# Altium schematic sheet 19 RADIATOR.SchDoc
size 420 x 297 mm; Address1: Address1; Address2: Address2; Address3: Address3; Address4: Address4; DocumentNumber: АБВГ.123456.001 Э3; SheetNumber: 19; SheetTotal: 23; Scale: 1:1; DocumentType: Схема электрическая принципиальная; FirstReferrence: АБВГ.123456.001
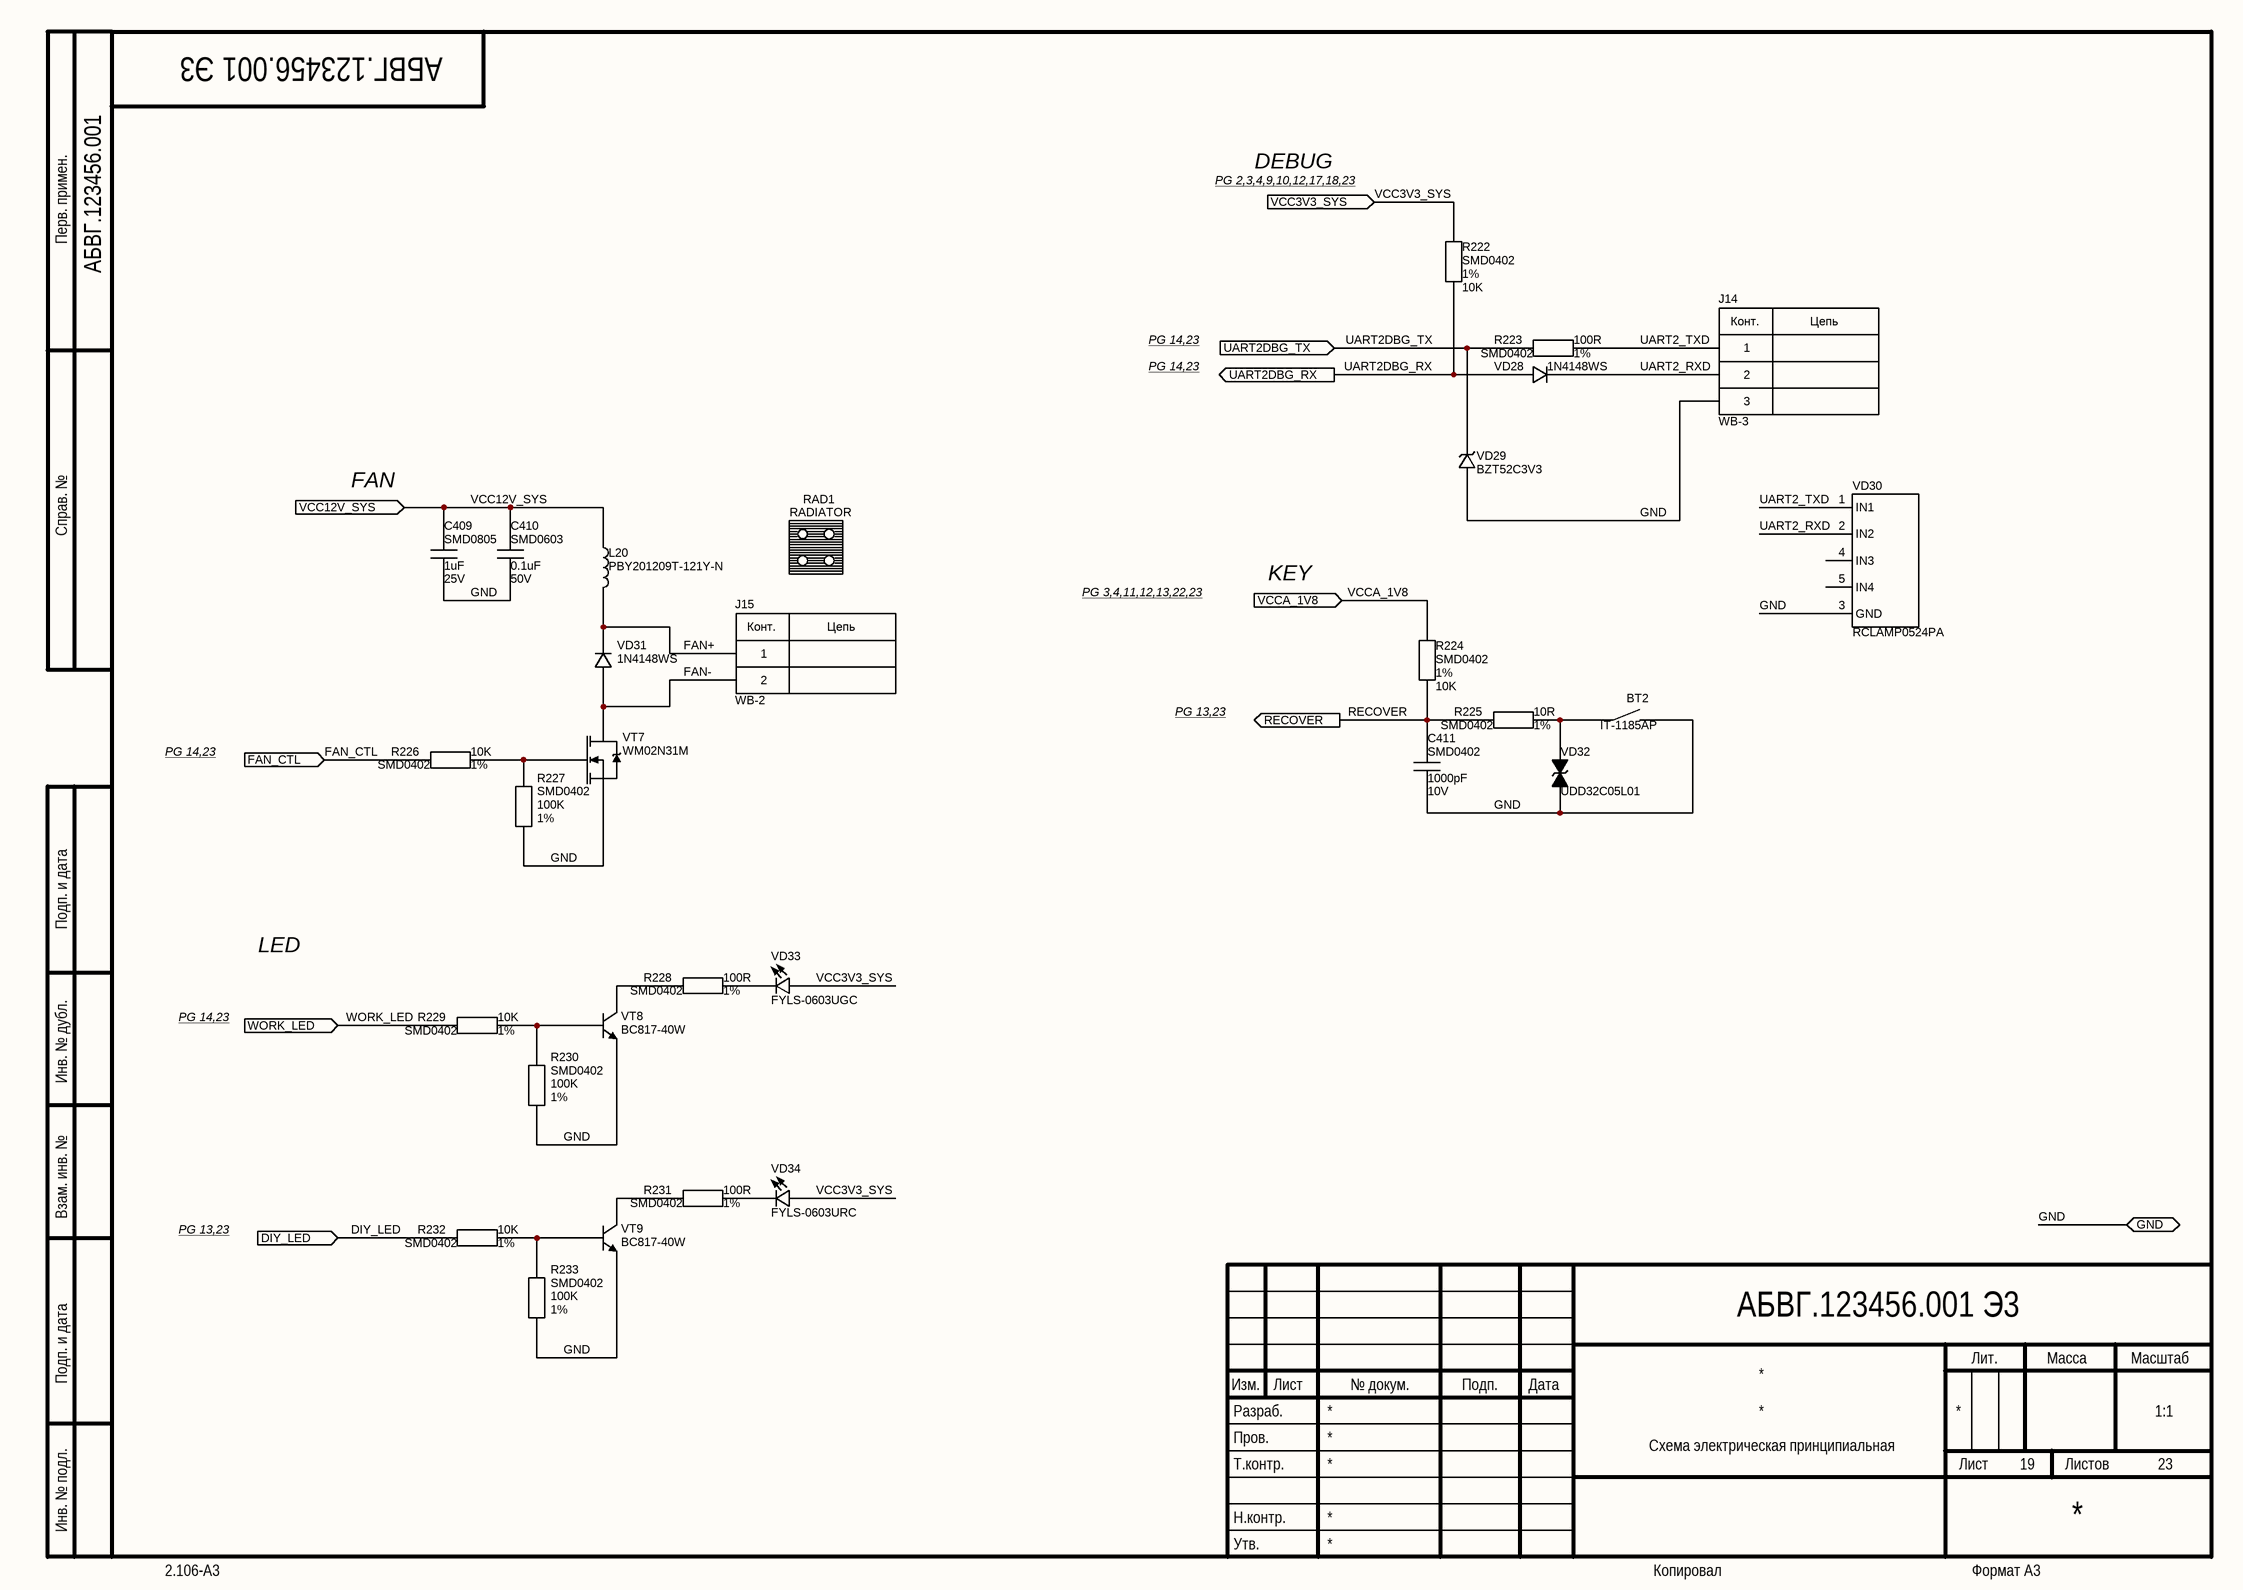
[diagram p0: 19 RADIATOR.SchDoc]

## Parts
BT2  IT-1185AP  [IT-1185AP]
C409  Package: SMD0805  Voltage: 25V  [CAP_SMD_0805]  (hidden comment: 1uF)
C410  Package: SMD0603  Voltage: 50V  [CAP_SMD_0603]  (hidden comment: 0.1uF)
C411  Package: SMD0402  Voltage: 10V  [CAP_SMD_0402]  (hidden comment: 1000pF)
J14  WB-3  [WB-3]
J15  WB-2  [WB-2]
L20  value PBY201209T-121Y-N  [IND_SMD_0805]  (hidden comment: Value)
R222  Package: SMD0402  Tolerance: 1%  [RES_SMD_0402]  (hidden comment: 10K)
R223  Package: SMD0402  Tolerance: 1%  [RES_SMD_0402]  (hidden comment: 100R)
R224  Package: SMD0402  Tolerance: 1%  [RES_SMD_0402]  (hidden comment: 10K)
R225  Package: SMD0402  Tolerance: 1%  [RES_SMD_0402]  (hidden comment: 10R)
R226  Package: SMD0402  Tolerance: 1%  [RES_SMD_0402]  (hidden comment: 10K)
R227  Package: SMD0402  Tolerance: 1%  [RES_SMD_0402]  (hidden comment: 100K)
R228  Package: SMD0402  Tolerance: 1%  [RES_SMD_0402]  (hidden comment: 100R)
R229  Package: SMD0402  Tolerance: 1%  [RES_SMD_0402]  (hidden comment: 10K)
R230  Package: SMD0402  Tolerance: 1%  [RES_SMD_0402]  (hidden comment: 100K)
R231  Package: SMD0402  Tolerance: 1%  [RES_SMD_0402]  (hidden comment: 100R)
R232  Package: SMD0402  Tolerance: 1%  [RES_SMD_0402]  (hidden comment: 10K)
R233  Package: SMD0402  Tolerance: 1%  [RES_SMD_0402]  (hidden comment: 100K)
RAD1  RADIATOR  [RK3399_RADIATOR_2]
VD28  value 1N4148WS  [SOD323]  (hidden comment: Diode)
VD29  BZT52C3V3  [SOD323]
VD30  RCLAMP0524PA  [RCLAMP0524PA]
VD31  value 1N4148WS  [SOD323]  (hidden comment: Diode)
VD32  value UDD32C05L01  [SOD323]  (hidden comment: TVS_Diode)
VD33  FYLS-0603UGC  [LED_0603]
VD34  FYLS-0603URC  [LED_0603]
VT7  value WM02N31M  [SOT23]  (hidden comment: Value)
VT8  BC817-40W  [SC-70]
VT9  BC817-40W  [SC-70]

## Ports
DIY_LED (in), FAN_CTL (in), GND (bidir), RECOVER (out), UART2DBG_RX (out), UART2DBG_TX (in), VCC3V3_SYS (in), VCC12V_SYS (in), VCCA_1V8 (in), WORK_LED (in)

## Nets
DIY_LED: R232.2 ; port DIY_LED
FAN+: J15.1 L20.1 VD31.2(C)
FAN-: J15.2 VD31.1(A) VT7.3(D)
FAN_CTL: R226.2 ; port FAN_CTL
GND: BT2.2 C409.1 C410.1 C411.1 J14.3 R227.1 R230.1 R233.1 VD29.1(A) VD30.3(GND) VD32.1(A) VT7.2(S) VT8.2(E) VT9.2(E) ; port GND
RECOVER: C411.2 R224.1 R225.1 ; port RECOVER
UART2_RXD: J14.2 VD28.2(C) VD30.2(IN2)
UART2_TXD: J14.1 R223.2 VD30.1(IN1)
UART2DBG_RX: R222.1 VD28.1(A) ; port UART2DBG_RX
UART2DBG_TX: R223.1 VD29.2(C) ; port UART2DBG_TX
VCC3V3_SYS: R222.2 VD33.1(A) VD34.1(A) ; port VCC3V3_SYS
VCC12V_SYS: C409.2 C410.2 L20.2 ; port VCC12V_SYS
VCCA_1V8: R224.2 ; port VCCA_1V8
WORK_LED: R229.2 ; port WORK_LED
NetBT2_1: BT2.1 R225.2 VD32.2(C)
NetR226_1: R226.1 R227.2 VT7.1(G)
NetR228_1: R228.1 VT8.3(C)
NetR228_2: R228.2 VD33.2(C)
NetR229_1: R229.1 R230.2 VT8.1(B)
NetR231_1: R231.1 VT9.3(C)
NetR231_2: R231.2 VD34.2(C)
NetR232_1: R232.1 R233.2 VT9.1(B)

Not connected (* = marked no-connect by the designer): RAD1 1 2 3 4; VD30 4(IN3) 5(IN4)

## Notes on the sheet
- PG 2,3,4,9,10,12,17,18,23
- DEBUG
- Перв. примен.
- PG 14,23
- Справ. №
- FAN
- PG 3,4,11,12,13,22,23
- KEY
- PG 13,23
- Подп. и дата
- LED
- Инв. № дубл.
- Взам. инв. №
- Разраб.
- Изм.
- Лист
- № докум.
- Подп.
- Дата
- Лит.
- Масса
- Масштаб
- Пров.
- Т.контр.
- Листов
- Инв. № подл.
- Утв.
- Н.контр.
- 2.106-A3
- Копировал
- Формат А3
- (in symbol CON2) Конт.; Цепь
- (in symbol CON3) Конт.; Цепь

## Library data of the parts
BT2 = Button_2pin: ComponentType: *; Manufacter: *; Package: IT-1185AP; PartNumber: IT-1185AP; ClassName: *; Value: IT-1185AP
C409 = Ceramic_Cap: PartNumber: CC0805KKX7R8BB105; ComponentType: SMD Ceramic Chip Capacitor; Manufacter: *; Tolerance: *; ClassName: *; Value: 1uF
C410 = Ceramic_Cap: PartNumber: CC0603KRX7R9BB104; ComponentType: SMD Ceramic Chip Capacitor; Manufacter: *; Tolerance: *; ClassName: *; Value: 0.1uF
C411 = Ceramic_Cap: PartNumber: CC0402KRX7R9BB102; ComponentType: SMD Ceramic Chip Capacitor; Manufacter: *; Tolerance: *; ClassName: *; Value: 1000pF
J14 = CON3: PartNumber: DS1066-03M(MW-3M); Manufacter: *; Package: WB-3; ClassName: *; Value: WB-3
J15 = CON2: PartNumber: DS1066-02M(MW-2M); ComponentType: *; Manufacter: *; Package: WB-2; ClassName: *; Value: WB-2
L20 = Inductor_smal: ComponentType: *; Manufacter: *; Package: SMD0805; PartNumber: PBY201209T-121Y-N; ClassName: *
R222 R224 R226 R229 R232 = Chip_Res: PartNumber: RC0402FR-0710KL; ComponentType: SMD Chip Resistor; Manufacter: *; Voltage: *; ClassName: *; Value: 10K
R223 R228 R231 = Chip_Res: PartNumber: RC0402FR-07100RL; ComponentType: SMD Chip Resistor; Manufacter: *; Voltage: *; ClassName: *; Value: 100R
R225 = Chip_Res: PartNumber: RC0402FR-0710RL; ComponentType: SMD Chip Resistor; Manufacter: *; Voltage: *; ClassName: *; Value: 10R
R227 R230 R233 = Chip_Res: PartNumber: RC0402FR-07100KL; ComponentType: SMD Chip Resistor; Manufacter: *; Voltage: *; ClassName: *; Value: 100K
RAD1 = RK3399_RADIATOR_1: ComponentType: SMD Chip Resistor; Manufacter: *; Voltage: *; ClassName: *; Tolerance: *; PartNumber: *; Package: RADIATOR _6x5.2mm; Value: RADIATOR
VD29 = ZenerDiode: ComponentType: *; Manufacter: *; Package: SOD323; PartNumber: BZT52C3V3; ClassName: *; Value: BZT52C3V3
VD33 VD34 = LED: ComponentType: *; Manufacter: *; Package: SMD0603
  VD33: PartNumber: FYLS-0603UGC; Value: FYLS-0603UGC
  VD34: PartNumber: FYLS-0603URC; Value: FYLS-0603URC
VT7 = MOSFET_N: ComponentType: *; Manufacter: *; Package: SOT23; PartNumber: WM02N31M; ClassName: *
VT8 VT9 = NPN_BEC: ComponentType: *; Manufacter: *; Package: SC-70; PartNumber: BC817-40W; ClassName: *; Value: BC817-40W
VD28 VD31 = Diode: ComponentType: *; Manufacter: *; Package: SOD323; PartNumber: 1N4148WS; ClassName: *
VD30 = RCLAMP0524PA: ComponentType: *; Manufacter: *; Package: RCLAMP0524PA; PartNumber: RCLAMP0524PA; ClassName: *; Value: RCLAMP0524PA
VD32 = TVS_Diode: ComponentType: *; Manufacter: *; Package: SOD323; PartNumber: UDD32C05L01; ClassName: *